# EAGLE schematic AZR3350 (EAGLE 9.2.2)
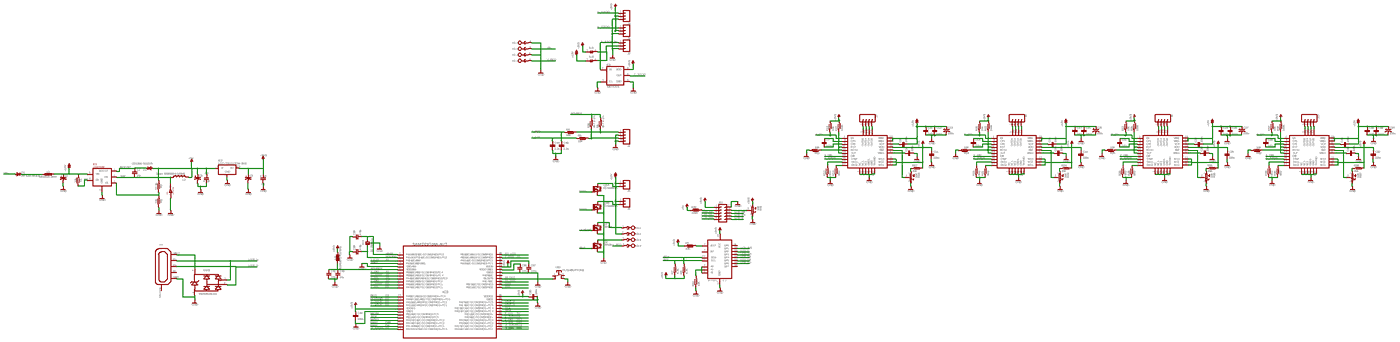
[diagram p0: schematic, sheet 1, overview]
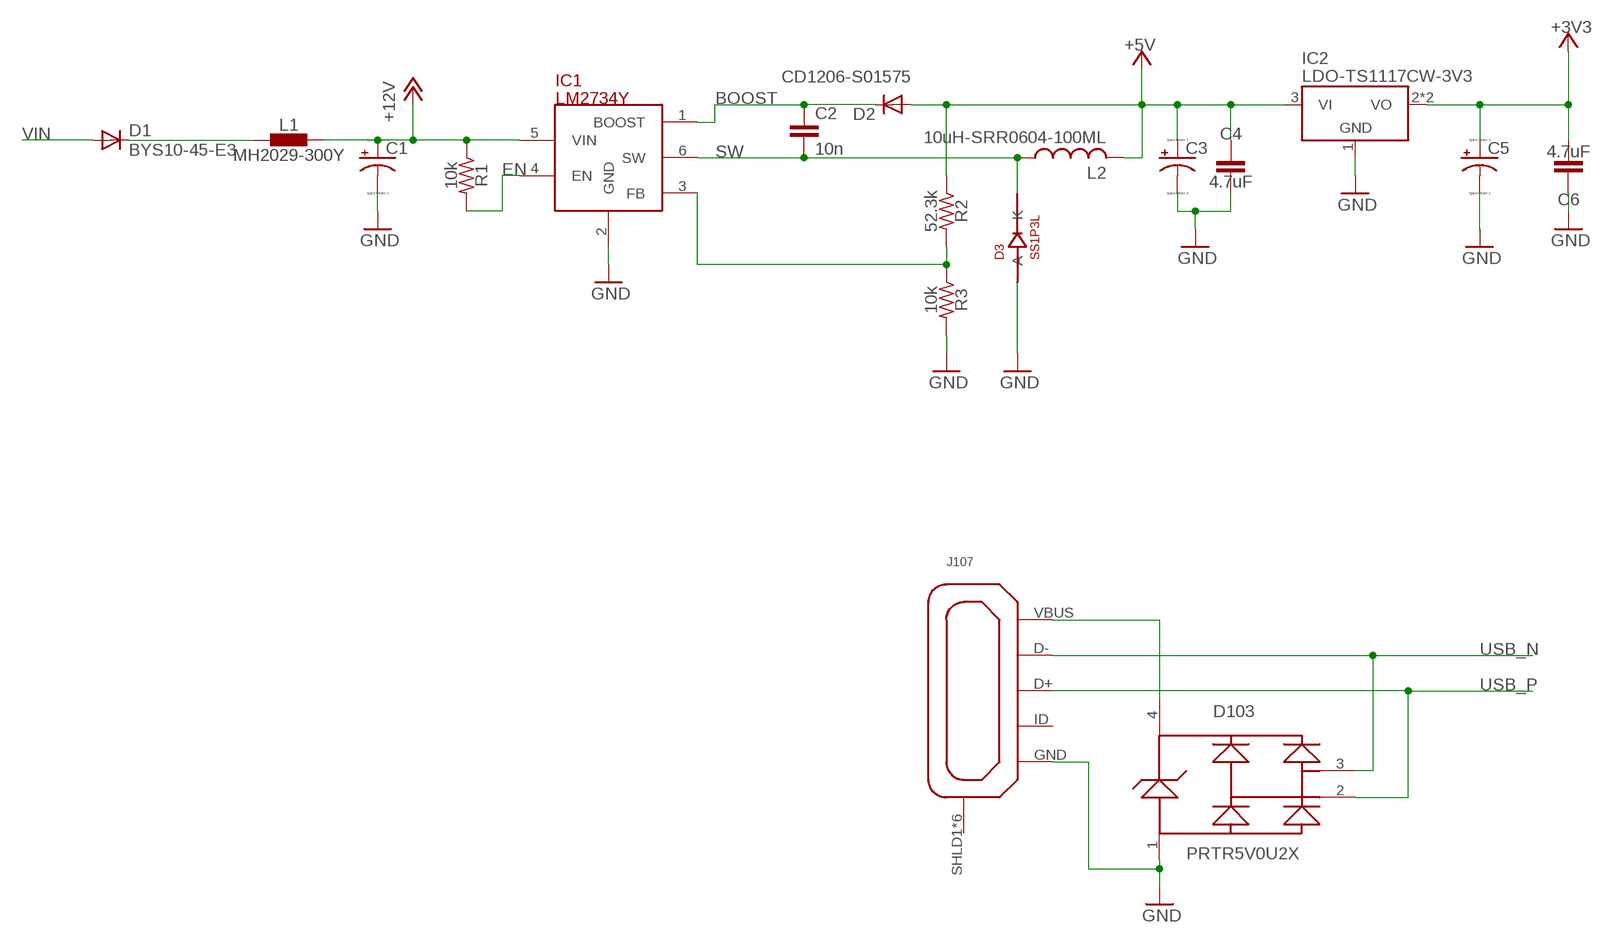
[diagram p1: schematic, sheet 1, part 1 of 4]
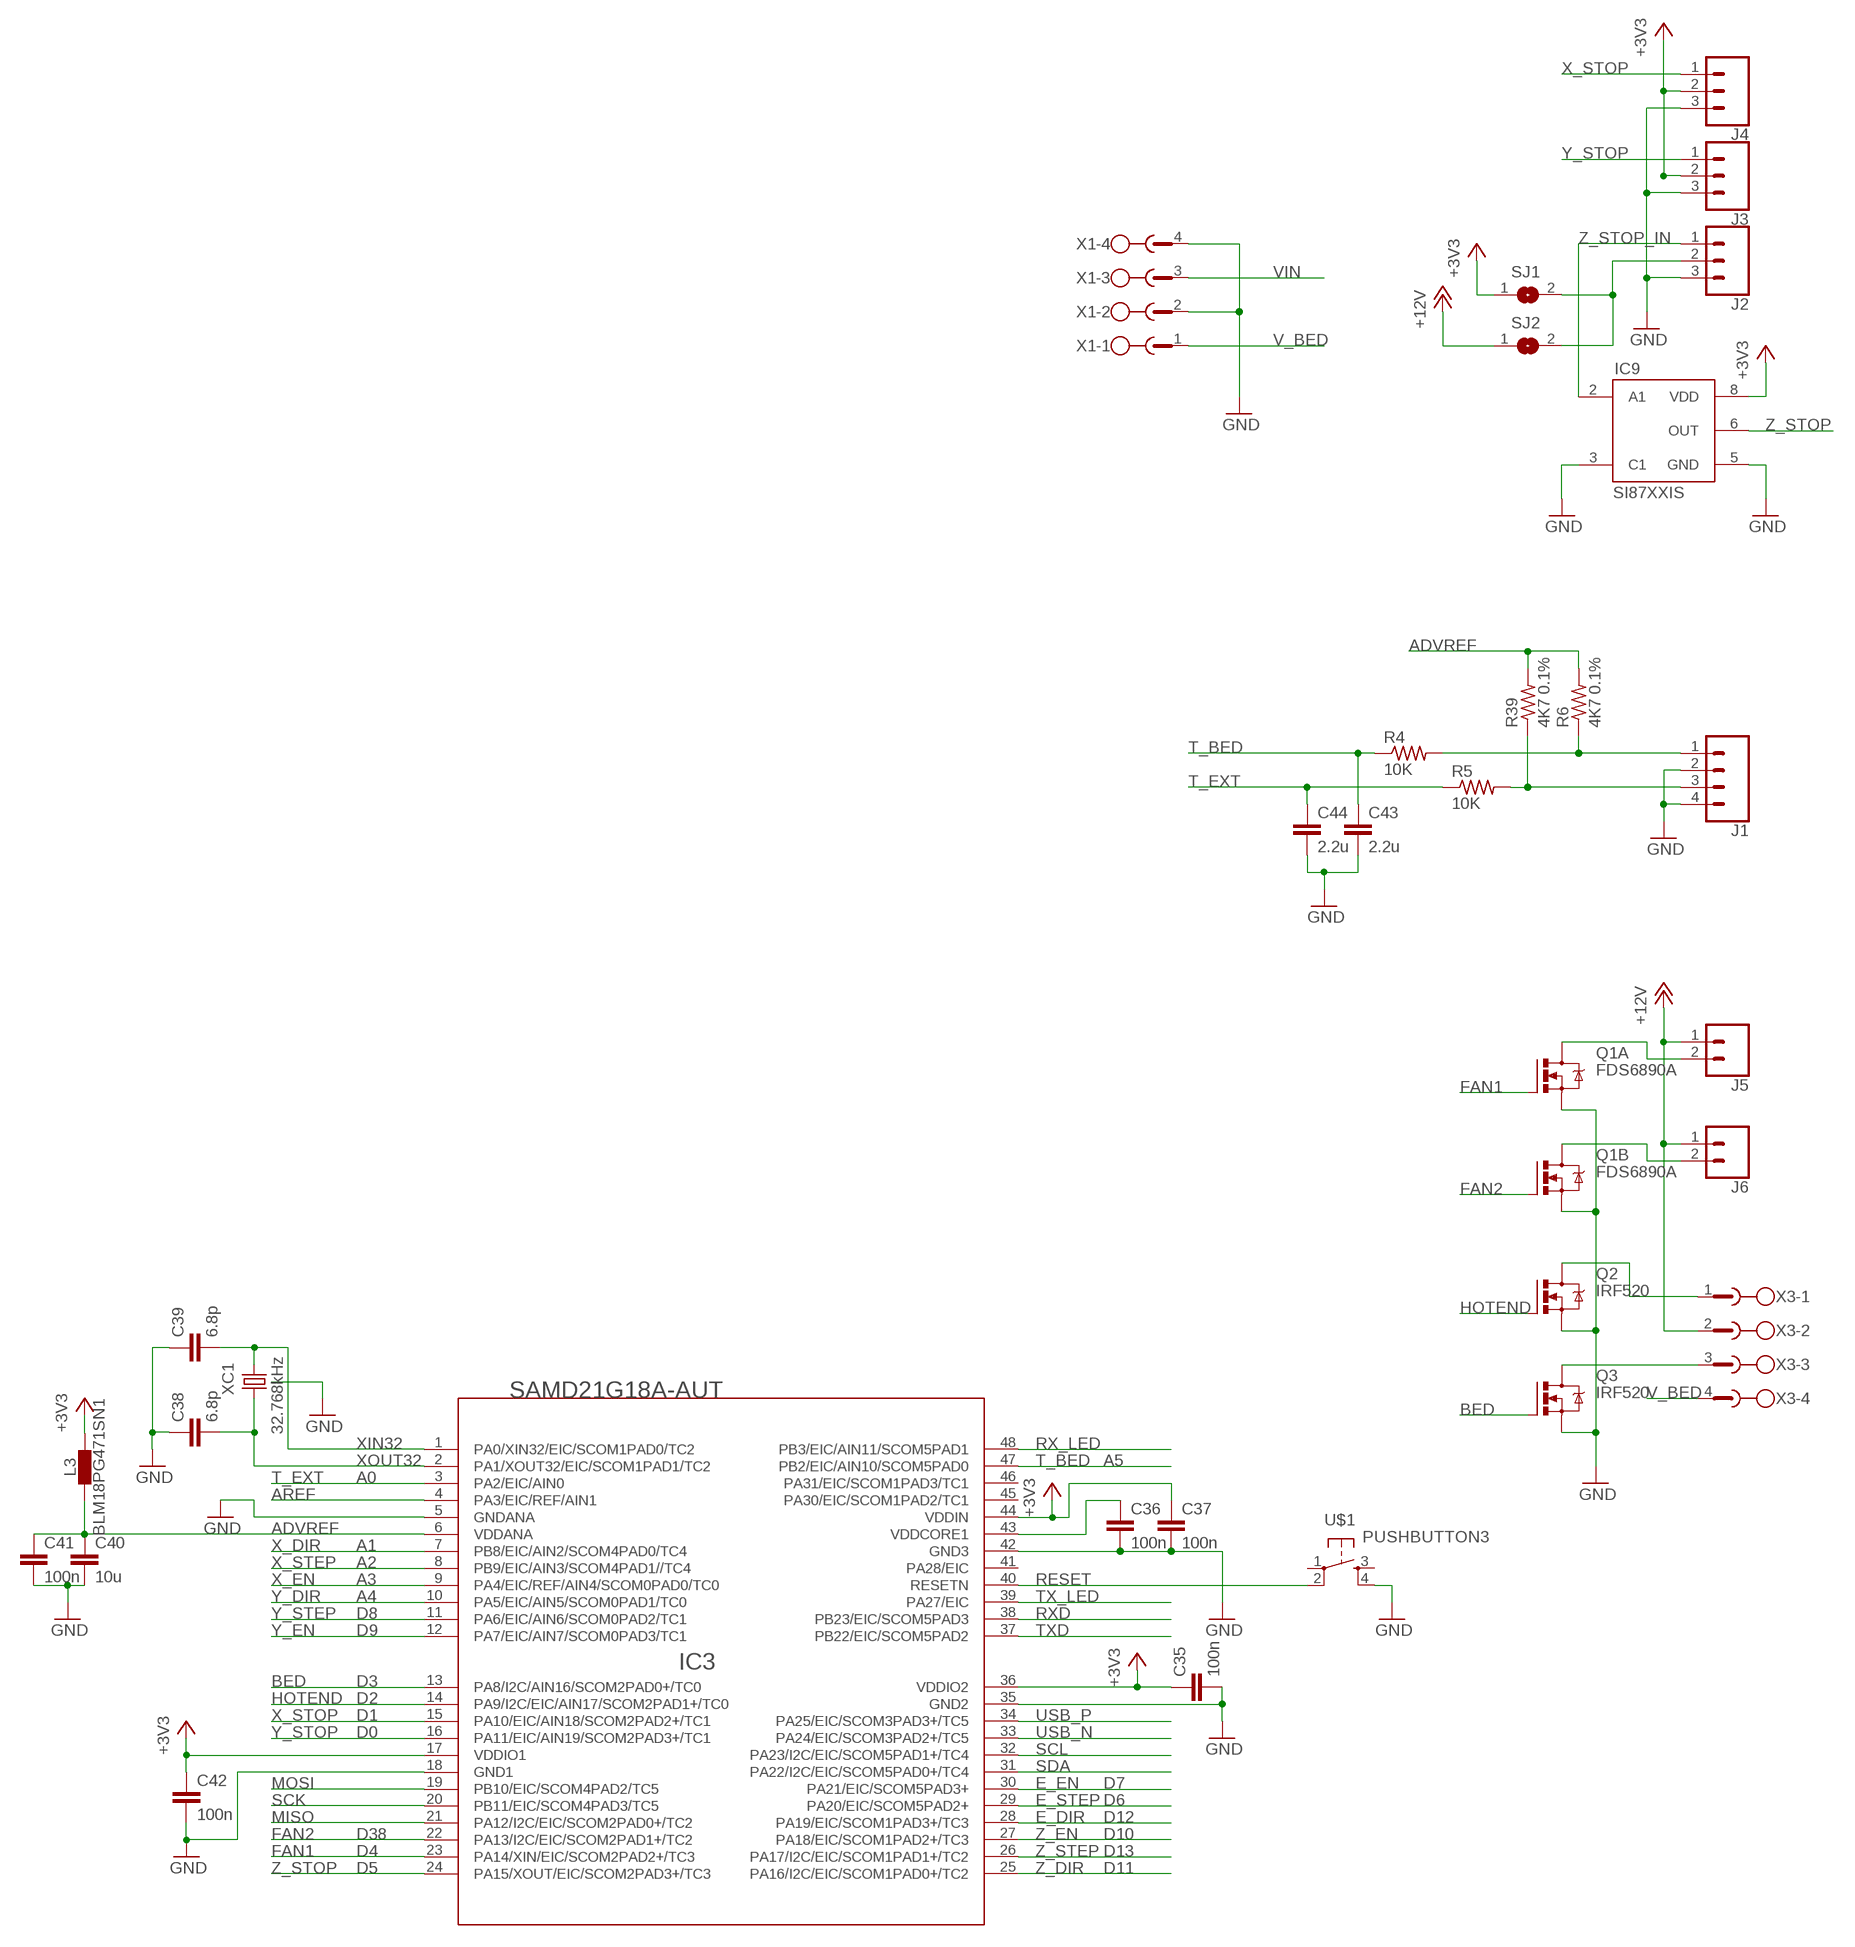
[diagram p2: schematic, sheet 1, part 2 of 4]
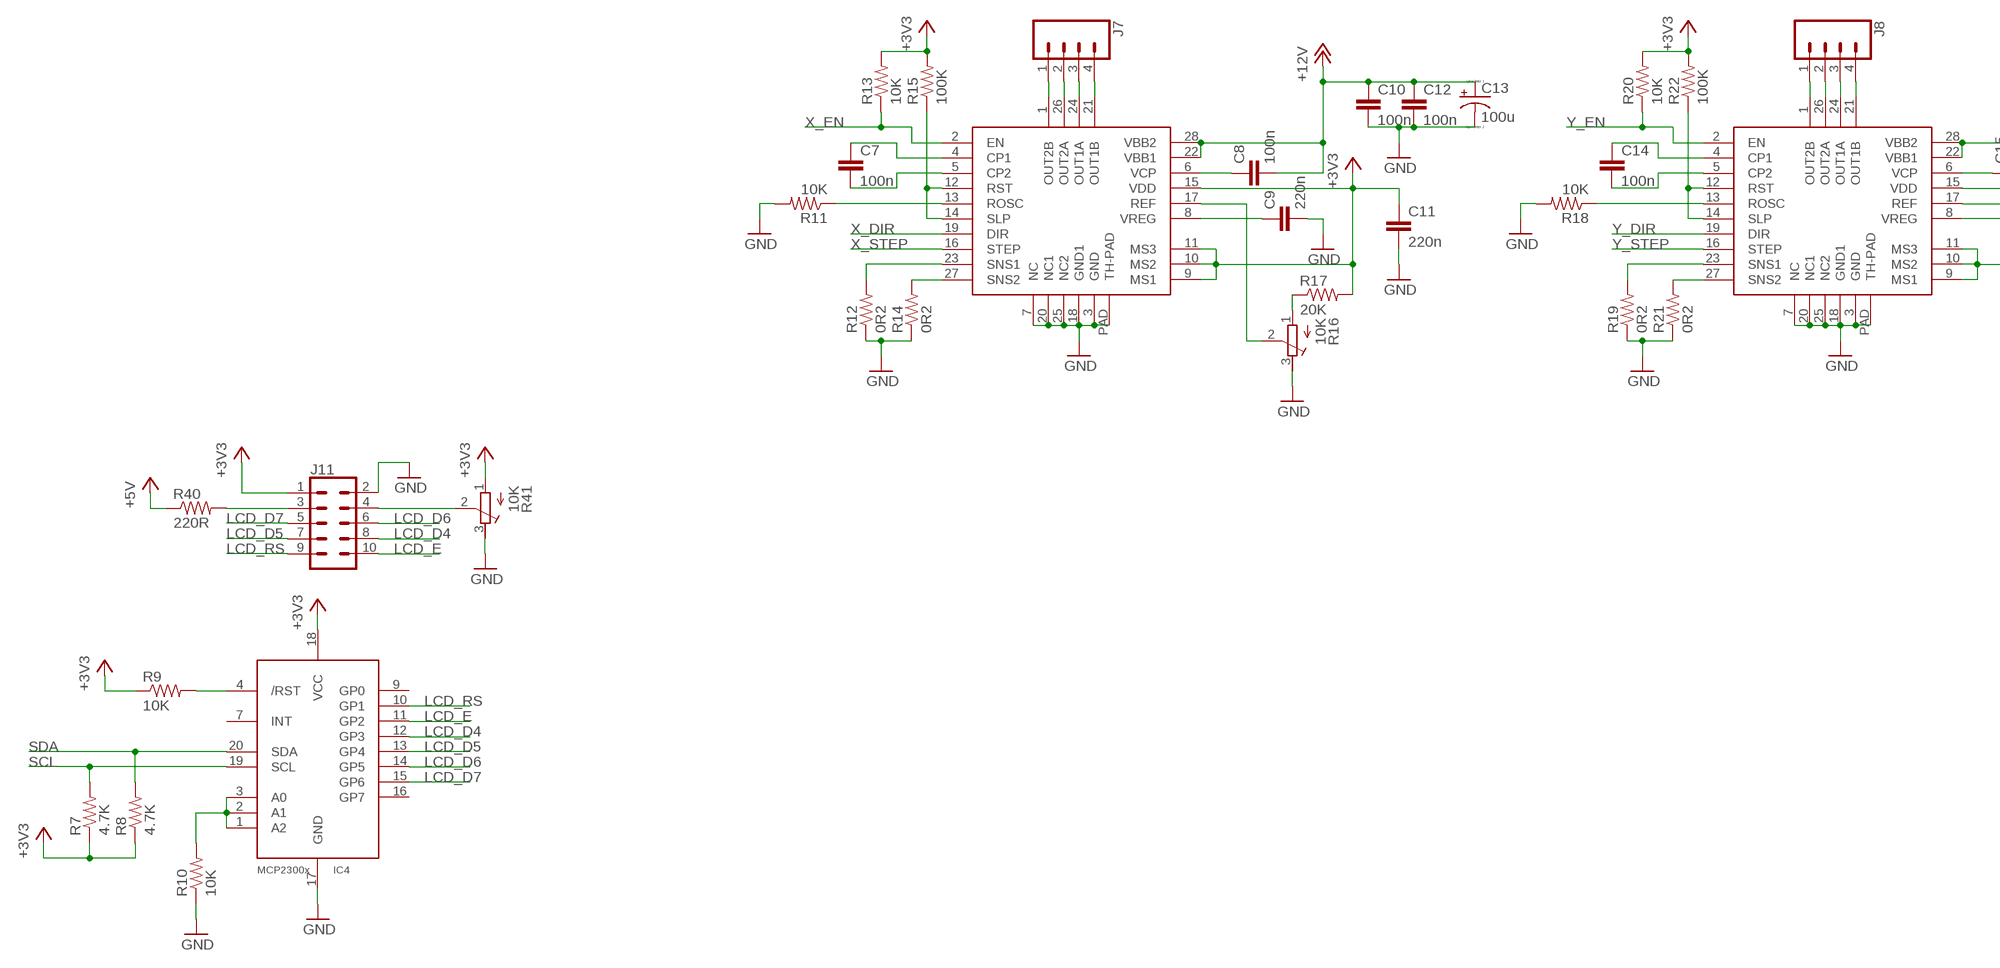
[diagram p3: schematic, sheet 1, part 3 of 4]
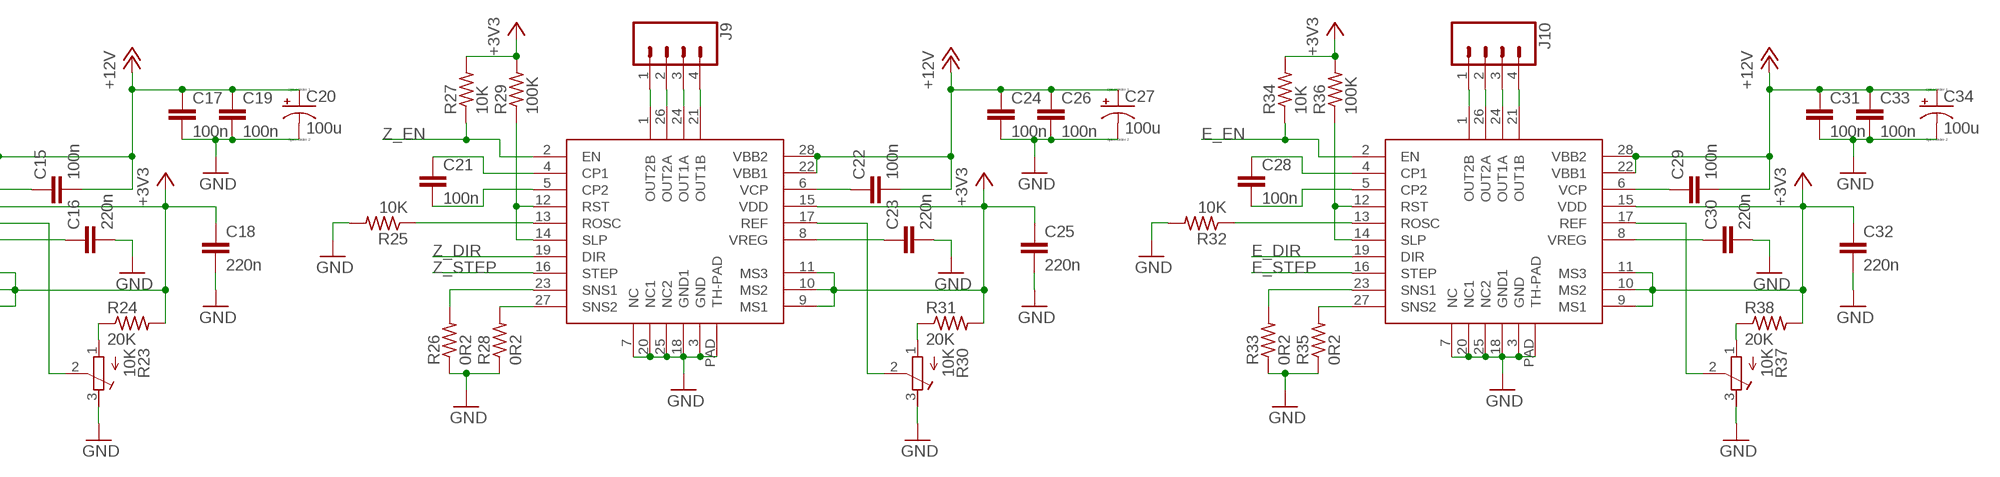
[diagram p4: schematic, sheet 1, part 4 of 4]

## Parts
C1  10uF  CPOL-USD  [PANASONIC_D]
C2  10n  C-EUC0402  [C0402]
C3  47u  CPOL-USD  [PANASONIC_D]
C4  4.7uF  C-EUC0402  [C0402]
C5  10uF  CPOL-USD  [PANASONIC_D]
C6  4.7uF  C-EUC0402  [C0402]
C7  100n  C-EUC0402  [C0402]
C8  100n  C-EUC0402  [C0402]
C9  220n  C-EUC0402  [C0402]
C10  100n  C-EUC0402  [C0402]
C11  220n  C-EUC0402  [C0402]
C12  100n  C-EUC0402  [C0402]
C13  100u  CPOL-USD  [PANASONIC_D]
C14  100n  C-EUC0402  [C0402]
C15  100n  C-EUC0402  [C0402]
C16  220n  C-EUC0402  [C0402]
C17  100n  C-EUC0402  [C0402]
C18  220n  C-EUC0402  [C0402]
C19  100n  C-EUC0402  [C0402]
C20  100u  CPOL-USD  [PANASONIC_D]
C21  100n  C-EUC0402  [C0402]
C22  100n  C-EUC0402  [C0402]
C23  220n  C-EUC0402  [C0402]
C24  100n  C-EUC0402  [C0402]
C25  220n  C-EUC0402  [C0402]
C26  100n  C-EUC0402  [C0402]
C27  100u  CPOL-USD  [PANASONIC_D]
C28  100n  C-EUC0402  [C0402]
C29  100n  C-EUC0402  [C0402]
C30  220n  C-EUC0402  [C0402]
C31  100n  C-EUC0402  [C0402]
C32  220n  C-EUC0402  [C0402]
C33  100n  C-EUC0402  [C0402]
C34  100u  CPOL-USD  [PANASONIC_D]
C35  100n  C-EUC0402  [C0402]
C36  100n  C-EUC0402  [C0402]
C37  100n  C-EUC0402  [C0402]
C38  6.8p  C-EUC0402  [C0402]
C39  6.8p  C-EUC0402  [C0402]
C40  10u  C-EUC0603  [C0603]
C41  100n  C-EUC0402  [C0402]
C42  100n  C-EUC0402  [C0402]
C43  2.2u  C-EUC0402  [C0402]
C44  2.2u  C-EUC0402  [C0402]
D1  BYS10-45-E3  0012_CD1206-S01575  [MINIMELF]
D2  CD1206-S01575  0012_CD1206-S01575  [MINIMELF]
D3  SS1P3L  0025_SS1P3L-M3/84A  [DO220AAL]
D103  PRTR5V0U2XB  [SOT143B]
IC1  LM2734Y  0179_LM2734YMK  [SOT23-6]
IC2  LDO-TS1117CW-3V3  [SOT223]
IC3  SAMD21G18A-AUT  SAMD21G18A  [TQFP48]
IC4  MCP23008  [QFN20]
IC5  A4988  [QFN28-TP]
IC6  A4988  [QFN28-TP]
IC7  A4988  [QFN28-TP]
IC8  A4988  [QFN28-TP]
IC9  SI87XXIS  [SOIC08-FAIRCHILD]
J1  CONN_04SMALL  [1X04_SMALL]
J2  455-1750-1-ND  CONN_03SMALL  [1X03_SMALL]
J3  455-1750-1-ND  CONN_03SMALL  [1X03_SMALL]
J4  455-1750-1-ND  CONN_03SMALL  [1X03_SMALL]
J5  CONN_02  [1X02]
J6  CONN_02  [1X02]
J7  CONN_04  [1X04]
J8  CONN_04  [1X04]
J9  CONN_04  [1X04]
J10  CONN_04  [1X04]
J11  CONN_05X2PTH  [2X5]
J107  ZX62-AB-5PA  [USB-MICRO-10103594]
L1  MH2029-300Y  INDUCTOR-0805  [C0805]
L2  10uH-SRR0604-100ML  0031_SRR0604-100ML  [SRR0604]
L3  BLM18PG471SN1  INDUCTOR-0603  [C0603]
Q1  FDS6890A  [M08A]
Q2  IRF520  [TO220BV]
Q3  IRF520  [TO220BV]
R1  10k  R-US_R0402  [R0402]
R2  52.3k  R-US_R0402  [R0402]
R3  10k  R-US_R0402  [R0402]
R4  10K  R-US_R0402  [R0402]
R5  10K  R-US_R0402  [R0402]
R6  4K7 0.1%  R-US_R0402  [R0402]
R7  4.7K  R-US_R0402  [R0402]
R8  4.7K  R-US_R0402  [R0402]
R9  10K  R-US_R0402  [R0402]
R10  10K  R-US_R0402  [R0402]
R11  10K  R-US_R0402  [R0402]
R12  0R2  R-US_R0805  [R0805]
R13  10K  R-US_R0402  [R0402]
R14  0R2  R-US_R0805  [R0805]
R15  100K  R-US_R0402  [R0402]
R16  10K  R-TRIMM3103  [RTRIM3103]
R17  20K  R-US_R0402  [R0402]
R18  10K  R-US_R0402  [R0402]
R19  0R2  R-US_R0805  [R0805]
R20  10K  R-US_R0402  [R0402]
R21  0R2  R-US_R0805  [R0805]
R22  100K  R-US_R0402  [R0402]
R23  10K  R-TRIMM3103  [RTRIM3103]
R24  20K  R-US_R0402  [R0402]
R25  10K  R-US_R0402  [R0402]
R26  0R2  R-US_R0805  [R0805]
R27  10K  R-US_R0402  [R0402]
R28  0R2  R-US_R0805  [R0805]
R29  100K  R-US_R0402  [R0402]
R30  10K  R-TRIMM3103  [RTRIM3103]
R31  20K  R-US_R0402  [R0402]
R32  10K  R-US_R0402  [R0402]
R33  0R2  R-US_R0805  [R0805]
R34  10K  R-US_R0402  [R0402]
R35  0R2  R-US_R0805  [R0805]
R36  100K  R-US_R0402  [R0402]
R37  10K  R-TRIMM3103  [RTRIM3103]
R38  20K  R-US_R0402  [R0402]
R39  4K7 0.1%  R-US_R0402  [R0402]
R40  220R  R-US_R0402  [R0402]
R41  10K  R-TRIMM3103  [RTRIM3103]
SJ1  SJ  [SJ]
SJ2  SJ  [SJ]
U$1  PUSHBUTTON3  [TS42_4PINS]
X1  MSTBA4  [MSTBA4]
X3  MSTBV4  [MSTBV4]
XC1  32.768kHz  CRYSTALSMD  [CRYSTAL_TC26SMD]

## Nets
+3V3: C5.+ C6.2 C11.1 C18.1 C25.1 C32.1 C35.1 C37.1 C42.1 IC2.2(VO) IC2.4(VO) IC3.17(VDDIO1) IC3.36(VDDIO2) IC3.44(VDDIN) IC4.18(VCC) IC5.9(MS1) IC5.10(MS2) IC5.11(MS3) IC5.15(VDD) IC6.9(MS1) IC6.10(MS2) IC6.11(MS3) IC6.15(VDD) IC7.9(MS1) IC7.10(MS2) IC7.11(MS3) IC7.15(VDD) IC8.9(MS1) IC8.10(MS2) IC8.11(MS3) IC8.15(VDD) IC9.8(VDD) J3.2 J4.2 J11.1 L3.2 R7.1 R8.1 R9.1 R13.2 R15.2 R17.2 R20.2 R22.2 R24.2 R27.2 R29.2 R31.2 R34.2 R36.2 R38.2 R41.1(A) SJ1.1
+5V [usbvcc]: C3.+ C4.1 D2.A IC2.3(VI) L2.P$2 R2.1 R40.1
+12V: C1.+ C8.2 C10.1 C12.1 C13.+ C15.2 C17.1 C19.1 C20.+ C22.2 C24.1 C26.1 C27.+ C29.2 C31.1 C33.1 C34.+ IC1.5(VIN) IC5.22(VBB1) IC5.28(VBB2) IC6.22(VBB1) IC6.28(VBB2) IC7.22(VBB1) IC7.28(VBB2) IC8.22(VBB1) IC8.28(VBB2) J5.1 J6.1 L1.2 R1.1 SJ2.1 X3.2
ADVREF: C40.1 C41.1 IC3.6(VDDANA) L3.1 R6.2 R39.2
AREF: IC3.4(PA3/EIC/REF/AIN1)
BED: IC3.13(PA8/I2C/AIN16/SCOM2PAD0+/TC0) Q3.G
BOOST: C2.1 D2.C IC1.1(BOOST)
CP1E: C28.1 IC8.4(CP1)
CP1X: C7.1 IC5.4(CP1)
CP1Y: C14.1 IC6.4(CP1)
CP1Z: C21.1 IC7.4(CP1)
CP2E: C28.2 IC8.5(CP2)
CP2X: C7.2 IC5.5(CP2)
CP2Y: C14.2 IC6.5(CP2)
CP2Z: C21.2 IC7.5(CP2)
E_DIR: IC3.28(PA19/EIC/SCOM1PAD3+/TC3) IC8.19(DIR)
E_EN: IC3.30(PA21/EIC/SCOM5PAD3+) IC8.2(EN) R34.1
E_STEP: IC3.29(PA20/EIC/SCOM5PAD2+) IC8.16(STEP)
EN: IC1.4(EN) R1.2
FAN1: IC3.23(PA14/XIN/EIC/SCOM2PAD2+/TC3) Q1.2(A:G)
FAN2: IC3.22(PA13/I2C/EIC/SCOM2PAD1+/TC2) Q1.4(B:G)
FB: IC1.3(FB) R2.2 R3.1
GND: C1.- C3.- C4.2 C5.- C6.1 C9.2 C10.2 C11.2 C12.2 C13.- C16.2 C17.2 C18.2 C19.2 C20.- C23.2 C24.2 C25.2 C26.2 C27.- C30.2 C31.2 C32.2 C33.2 C34.- C35.2 C36.2 C37.2 C38.1 C39.1 C40.2 C41.2 C42.2 C43.2 C44.2 D3.P$2(A) D103.1 IC1.2(GND) IC2.1(GND) IC3.5(GNDANA) IC3.18(GND1) IC3.35(GND2) IC3.42(GND3) IC4.17(GND) IC5.3(GND) IC5.7(NC) IC5.18(GND1) IC5.20(NC1) IC5.25(NC2) IC5.PAD(TH-PAD) IC6.3(GND) IC6.7(NC) IC6.18(GND1) IC6.20(NC1) IC6.25(NC2) IC6.PAD(TH-PAD) IC7.3(GND) IC7.7(NC) IC7.18(GND1) IC7.20(NC1) IC7.25(NC2) IC7.PAD(TH-PAD) IC8.3(GND) IC8.7(NC) IC8.18(GND1) IC8.20(NC1) IC8.25(NC2) IC8.PAD(TH-PAD) IC9.3(C1) IC9.5(GND) J1.2 J1.4 J2.3 J3.3 J4.3 J11.2 J107.GND Q1.1(A:S) Q1.3(B:S) Q2.S Q3.S R3.2 R10.1 R11.2 R12.1 R14.1 R16.3(E) R18.2 R19.1 R21.1 R23.3(E) R25.2 R26.1 R28.1 R30.3(E) R32.2 R33.1 R35.1 R37.3(E) R41.3(E) U$1.4 X1.2 X1.4 XC1.P$1(GND)
HOTEND: IC3.14(PA9/I2C/EIC/AIN17/SCOM2PAD1+/TC0) Q2.G
LCD_D4: IC4.12(GP3) J11.8
LCD_D5: IC4.13(GP4) J11.7
LCD_D6: IC4.14(GP5) J11.6
LCD_D7: IC4.15(GP6) J11.5
LCD_E: IC4.11(GP2) J11.10
LCD_RS: IC4.10(GP1) J11.9
MISO: IC3.21(PA12/I2C/EIC/SCOM2PAD0+/TC2)
MOSI: IC3.19(PB10/EIC/SCOM4PAD2/TC5)
N$1: D1.C L1.1
N$2: J1.1 R4.2 R6.1
N$3: J1.3 R5.2 R39.1
N$4: IC6.12(RST) IC6.14(SLP) R22.1
N$5: J11.3 R40.2
N$6: IC5.1(OUT2B) J7.1
N$7: IC5.26(OUT2A) J7.2
N$8: IC5.24(OUT1A) J7.3
N$9: IC5.21(OUT1B) J7.4
N$10: J11.4 R41.2(S)
N$11: D103.4 J107.VBUS(VUSB)
N$12: J2.2 SJ1.2 SJ2.2
N$14: IC6.1(OUT2B) J8.1
N$15: IC6.26(OUT2A) J8.2
N$16: IC6.24(OUT1A) J8.3
N$17: IC6.21(OUT1B) J8.4
N$19: R23.1(A) R24.1
N$21: J6.2 Q1.5(B:D) Q1.6(B:D)
N$22: J5.2 Q1.7(A:D) Q1.8(A:D)
N$23: Q2.D X3.1
N$24: Q3.D X3.3
N$28: IC4.4(/RST) R9.2
N$29: IC4.1(A2) IC4.2(A1) IC4.3(A0) R10.2
N$31: IC5.12(RST) IC5.14(SLP) R15.1
N$38: R16.1(A) R17.1
N$41: IC7.12(RST) IC7.14(SLP) R29.1
N$46: IC7.1(OUT2B) J9.1
N$47: IC7.26(OUT2A) J9.2
N$48: IC7.24(OUT1A) J9.3
N$49: IC7.21(OUT1B) J9.4
N$51: R30.1(A) R31.1
N$55: IC8.12(RST) IC8.14(SLP) R36.1
N$60: IC8.1(OUT2B) J10.1
N$61: IC8.26(OUT2A) J10.2
N$62: IC8.24(OUT1A) J10.3
N$63: IC8.21(OUT1B) J10.4
N$65: R37.1(A) R38.1
REFE: IC8.17(REF) R37.2(S)
REFX: IC5.17(REF) R16.2(S)
REFY: IC6.17(REF) R23.2(S)
REFZ: IC7.17(REF) R30.2(S)
RESET: IC3.40(RESETN) U$1.2
ROSCE: IC8.13(ROSC) R32.1
ROSCX: IC5.13(ROSC) R11.1
ROSCY: IC6.13(ROSC) R18.1
ROSCZ: IC7.13(ROSC) R25.1
RX_LED: IC3.48(PB3/EIC/AIN11/SCOM5PAD1)
RXD: IC3.38(PB23/EIC/SCOM5PAD3)
SCK: IC3.20(PB11/EIC/SCOM4PAD3/TC5)
SCL: IC3.32(PA23/I2C/EIC/SCOM5PAD1+/TC4) IC4.19(SCL) R7.2
SDA: IC3.31(PA22/I2C/EIC/SCOM5PAD0+/TC4) IC4.20(SDA) R8.2
SNS1E: IC8.23(SNS1) R33.2
SNS1X: IC5.23(SNS1) R12.2
SNS1Y: IC6.23(SNS1) R19.2
SNS1Z: IC7.23(SNS1) R26.2
SNS2E: IC8.27(SNS2) R35.2
SNS2X: IC5.27(SNS2) R14.2
SNS2Y: IC6.27(SNS2) R21.2
SNS2Z: IC7.27(SNS2) R28.2
SW [USB]: C2.2 D3.P$1(K) IC1.6(SW) L2.P$1
T_BED: C43.1 IC3.47(PB2/EIC/AIN10/SCOM5PAD0) R4.1
T_EXT: C44.1 IC3.3(PA2/EIC/AIN0) R5.1
TX_LED: IC3.39(PA27/EIC)
TXD: IC3.37(PB22/EIC/SCOM5PAD2)
USB_N [diff]: D103.3 IC3.33(PA24/EIC/SCOM3PAD2+/TC5) J107.D-
USB_P [diff]: D103.2 IC3.34(PA25/EIC/SCOM3PAD3+/TC5) J107.D+
V_BED: X1.1 X3.4
VCPE: C29.1 IC8.6(VCP)
VCPX: C8.1 IC5.6(VCP)
VCPY: C15.1 IC6.6(VCP)
VCPZ: C22.1 IC7.6(VCP)
VDDCORE: C36.1 IC3.43(VDDCORE1)
VIN: D1.A X1.3
VREGE: C30.1 IC8.8(VREG)
VREGX: C9.1 IC5.8(VREG)
VREGY: C16.1 IC6.8(VREG)
VREGZ: C23.1 IC7.8(VREG)
X_DIR: IC3.7(PB8/EIC/AIN2/SCOM4PAD0/TC4) IC5.19(DIR)
X_EN: IC3.9(PA4/EIC/REF/AIN4/SCOM0PAD0/TC0) IC5.2(EN) R13.1
X_STEP: IC3.8(PB9/EIC/AIN3/SCOM4PAD1//TC4) IC5.16(STEP)
X_STOP: IC3.15(PA10/EIC/AIN18/SCOM2PAD2+/TC1) J4.1
XIN32: C39.2 IC3.1(PA0/XIN32/EIC/SCOM1PAD0/TC2) XC1.2
XOUT32: C38.2 IC3.2(PA1/XOUT32/EIC/SCOM1PAD1/TC2) XC1.1
Y_DIR: IC3.10(PA5/EIC/AIN5/SCOM0PAD1/TC0) IC6.19(DIR)
Y_EN: IC3.12(PA7/EIC/AIN7/SCOM0PAD3/TC1) IC6.2(EN) R20.1
Y_STEP: IC3.11(PA6/EIC/AIN6/SCOM0PAD2/TC1) IC6.16(STEP)
Y_STOP: IC3.16(PA11/EIC/AIN19/SCOM2PAD3+/TC1) J3.1
Z_DIR: IC3.25(PA16/I2C/EIC/SCOM1PAD0+/TC2) IC7.19(DIR)
Z_EN: IC3.27(PA18/EIC/SCOM1PAD2+/TC3) IC7.2(EN) R27.1
Z_STEP: IC3.26(PA17/I2C/EIC/SCOM1PAD1+/TC2) IC7.16(STEP)
Z_STOP: IC3.24(PA15/XOUT/EIC/SCOM2PAD3+/TC3) IC9.6(OUT)
Z_STOP_IN: IC9.2(A1) J2.1
Unconnected: IC3.41(PA28/EIC) IC3.45(PA30/EIC/SCOM1PAD2/TC1) IC3.46(PA31/EIC/SCOM1PAD3/TC1) IC4.7(INT) IC4.9(GP0) IC4.16(GP7) J107.ID J107.SHLD1(SH) J107.SHLD2(SH) J107.SHLD3(SH) J107.SHLD4(SH) J107.SHLD5(SH) J107.SHLD6(SH) U$1.1 U$1.3

## Notes on the sheet
- A5
- A0
- A1
- A2
- A3
- A4
- D8
- D9
- D3
- D2
- D1
- D0
- D7
- D6
- D12
- D38 | D10
- D4 | D13
- D5 | D11

## Library data of the parts
C1 C3 C5 C13 C20 C27 C34 = resistor:CPOL-US: POLARIZED CAPACITOR, American symbol
C2 C4 C6-C12 C14-C19 C21-C26 C28-C33 C35-C44 = resistor:C-EU: CAPACITOR, European symbol
D1 = Diodi:0012_CD1206-S01575: small-signal high-speed Switching Diodes CD1206; CASE: 1206; MONTHLY_USAGE: _____; PART_NUMBER: CD1206-S01575; PRICE: _____; SUPPLIER: _____; TYPE: Diodi; VALUE: CD1206-S01575
D2 = Diodi:0012_CD1206-S01575: small-signal high-speed Switching Diodes CD1206; CASE: 1206; MONTHLY_USAGE: _____; PART_NUMBER: CD1206-S01575; PRICE: _____; SUPPLIER: _____; TYPE: Diodi
D3 = Diodi:0025_SS1P3L-M3/84A: 1A 30V Schottky Barrier Rectifiers -SS1P3L-M3/84A; CASE: SMP; MONTHLY_USAGE: _____; PART_NUMBER: SS1P3L-M3/84A; PRICE: _____; SUPPLIER: _____; TYPE: Diodi
D103 = Arduino:PRTR5V0U2X
IC1 = Circuito Integrato:0179_LM2734YMK: 1A Load Step-Down DC-DC Regulator - LM2734Y Switching; CASE: SOT23-5; MONTHLY_USAGE: _____; PART_NUMBER: LM2734YMK; PRICE: _____; SUPPLIER: _____; TYPE: Circuito_Integrato; VALUE: LM2734YMK
IC2 = we-power:LDO: LDOs TS1117 800mA max 15V - compatible NCP1117 1A max 20V TS9011 250mA max 12V - compatible AP2210 300mA max 15V TS5204 150mA max 16V
IC3 = Zero_V1.0:SAMD21G18A: Atmel D21 32bit ARM Cortex-M0 microcontroller - 48 PIN TQFP 256KB flash memory + 32KB SRAM
IC4 = misc:MCP23008
IC5-IC8 = RepRapjr:A4988
IC9 = misc:SI87XX
J1 = SparkFun-Connectors:CONN_04: Multi connection point. Often used as Generic Header-pin footprint for 0.1 inch spaced/style header connections On any of the 0.1 inch spaced packages, you can populate with these: Break Away Headers - Straight <https://www.sparkfun.com/products/116> (PRT-00116) Break Away Male Headers - Right Angle <https://www.sparkfun.com/products/553> (PRT-00553) Female Headers <https://www.sparkfun.com/products/115> (PRT-00115) Break Away Headers - Machine Pin <https://www.sparkfun.com/products/117> (PRT-00117) Break Away Female Headers - Swiss Machine Pin <https://www.sparkfun.com/products/743> (PRT-00743) For SCREWTERMINALS and SPRING TERMINALS visit here: Screw Terimnals on SparkFun.com <https://www.sparkfun.com/search/results?term=Screw+Terminals> (5mm/3.5mm/2.54mm spacing) This device is also useful as a general connection point to wire up your design to another part of your project. Our various solder wires solder well into these plated through hole pads. Hook-Up Wire - Assortment (Stranded, 22 AWG) <https://www.sparkfun.com/products/11375> (PRT-11375) Hook-Up Wire - Assortment (Solid Core, 22 AWG) <https://www.sparkfun.com/products/11367> (PRT-11367) View the entire wire category on our website here <https://www.sparkfun.com/categories/141> Special notes: Molex polarized connector foot print use with SKU : PRT-08231 with associated crimp pins and housings. 1MM SMD Version SKU: PRT-10208
J2-J4 = SparkFun-Connectors:CONN_03: Multi connection point. Often used as Generic Header-pin footprint for 0.1 inch spaced/style header connections On any of the 0.1 inch spaced packages, you can populate with these: Break Away Headers - Straight <https://www.sparkfun.com/products/116> (PRT-00116) Break Away Male Headers - Right Angle <https://www.sparkfun.com/products/553> (PRT-00553) Female Headers <https://www.sparkfun.com/products/115> (PRT-00115) Break Away Headers - Machine Pin <https://www.sparkfun.com/products/117> (PRT-00117) Break Away Female Headers - Swiss Machine Pin <https://www.sparkfun.com/products/743> (PRT-00743) Stackable Header - 3 Pin (Female, 0.1") <https://www.sparkfun.com/products/13875> (PRT-13875) For SCREWTERMINALS and SPRING TERMINALS visit here: Screw Terimnals on SparkFun.com <https://www.sparkfun.com/search/results?term=Screw+Terminals> (5mm/3.5mm/2.54mm spacing) This device is also useful as a general connection point to wire up your design to another part of your project. Our various solder wires solder well into these plated through hole pads. Hook-Up Wire - Assortment (Stranded, 22 AWG) <https://www.sparkfun.com/products/11375> (PRT-11375) Hook-Up Wire - Assortment (Solid Core, 22 AWG) <https://www.sparkfun.com/products/11367> (PRT-11367) View the entire wire category on our website here <https://www.sparkfun.com/categories/141> Special notes: Molex polarized connector foot print use with SKU : PRT-08232 with associated crimp pins and housings.
J5 J6 = SparkFun-Connectors:CONN_02: Multi connection point. Often used as Generic Header-pin footprint for 0.1 inch spaced/style header connections On any of the 0.1 inch spaced packages, you can populate with these: Break Away Headers - Straight <https://www.sparkfun.com/products/116> (PRT-00116) Break Away Male Headers - Right Angle <https://www.sparkfun.com/products/553> (PRT-00553) Female Headers <https://www.sparkfun.com/products/115> (PRT-00115) Break Away Headers - Machine Pin <https://www.sparkfun.com/products/117> (PRT-00117) Break Away Female Headers - Swiss Machine Pin <https://www.sparkfun.com/products/743> (PRT-00743) For SCREWTERMINALS and SPRING TERMINALS visit here: Screw Terimnals on SparkFun.com <https://www.sparkfun.com/search/results?term=Screw+Terminals> (5mm/3.5mm/2.54mm spacing) This device is also useful as a general connection point to wire up your design to another part of your project. Our various solder wires solder well into these plated through hole pads. Hook-Up Wire - Assortment (Stranded, 22 AWG) <https://www.sparkfun.com/products/11375> (PRT-11375) Hook-Up Wire - Assortment (Solid Core, 22 AWG) <https://www.sparkfun.com/products/11367> (PRT-11367) View the entire wire category on our website here <https://www.sparkfun.com/categories/141> Special notes: Molex polarized connector foot print use with: PRT-08233 with associated crimp pins and housings. 2.54_SCREWTERM for use with PRT-10571. 3.5mm Screw Terminal footprints for PRT-08084 5mm Screw Terminal footprints for use with PRT-08432
J7-J10 = SparkFun-Connectors:CONN_04: Multi connection point. Often used as Generic Header-pin footprint for 0.1 inch spaced/style header connections On any of the 0.1 inch spaced packages, you can populate with these: Break Away Headers - Straight <https://www.sparkfun.com/products/116> (PRT-00116) Break Away Male Headers - Right Angle <https://www.sparkfun.com/products/553> (PRT-00553) Female Headers <https://www.sparkfun.com/products/115> (PRT-00115) Break Away Headers - Machine Pin <https://www.sparkfun.com/products/117> (PRT-00117) Break Away Female Headers - Swiss Machine Pin <https://www.sparkfun.com/products/743> (PRT-00743) For SCREWTERMINALS and SPRING TERMINALS visit here: Screw Terimnals on SparkFun.com <https://www.sparkfun.com/search/results?term=Screw+Terminals> (5mm/3.5mm/2.54mm spacing) This device is also useful as a general connection point to wire up your design to another part of your project. Our various solder wires solder well into these plated through hole pads. Hook-Up Wire - Assortment (Stranded, 22 AWG) <https://www.sparkfun.com/products/11375> (PRT-11375) Hook-Up Wire - Assortment (Solid Core, 22 AWG) <https://www.sparkfun.com/products/11367> (PRT-11367) View the entire wire category on our website here <https://www.sparkfun.com/categories/141> Special notes: Molex polarized connector foot print use with SKU : PRT-08231 with associated crimp pins and housings. 1MM SMD Version SKU: PRT-10208; PROD_ID: CONN-09696
J11 = SparkFun-Connectors:CONN_05X2: Multi connection point. Often used as Generic Header-pin footprint for 0.1 inch spaced/style header connections For AVR SPI programming port, see special device with nice symbol: "AVR_SPI_PROG_5x2.dev" You can populate with any combo of single row headers, but if you'd like an exact match, check these: 2x5 AVR ICSP Male Header <https://www.sparkfun.com/products/778> (PRT-00778) 2x5 Pin Shrouded Header <https://www.sparkfun.com/products/8506> (PRT-08506) On any of the 0.1 inch spaced packages, you can populate with these: Break Away Headers - Straight <https://www.sparkfun.com/products/116> (PRT-00116) Break Away Male Headers - Right Angle <https://www.sparkfun.com/products/553> (PRT-00553) Female Headers <https://www.sparkfun.com/products/115> (PRT-00115) Break Away Headers - Machine Pin <https://www.sparkfun.com/products/117> (PRT-00117) Break Away Female Headers - Swiss Machine Pin <https://www.sparkfun.com/products/743> (PRT-00743) Special note: the shrouded connector mates well with our 5x2 ribbon cables: 2x5 Pin IDC Ribbon Cable <https://www.sparkfun.com/products/8535> (PRT-08535); PROD_ID: CONN-08499; SF_ID: PRT-0778
J107 = Arduino:ZX62-AB-5PA
L1 L3 = Arduino:INDUCTOR: Inductors
L2 = Induttanze:0031_SRR0604-100ML: SRR0604-100ML; CASE: SMD_6,5x6,5; MONTHLY_USAGE: _____; PART_NUMBER: SRR0604-100ML; PRICE: _____; SUPPLIER: _____; TYPE: Induttanze
Q1 = transistor-power:FDS6890A: Dual N-Channel 2.5V Specified PowerTrenchTM MOSFET Source: FDS6890A.pdf
Q2 Q3 = transistor-power:IRF520: HEXFET Power MOSFET
R1-R15 R17-R22 R24-R29 R31-R36 R38-R40 = resistor:R-US_: RESISTOR, American symbol
R16 R23 R30 R37 R41 = resistor:R-TRIMM: Trimm resistor
SJ1 SJ2 = jumper:SJ: SMD solder JUMPER
U$1 = Zero_V1.0:PUSHBUTTON3: TS42 Dongnan Electronics Tact switch VDC 12V - 50mA
X1 = con-phoenix-508:MSTBA4: PHOENIX; MF: FARNELL; MPN: 1757268; OC_FARNELL: 3705195; OC_NEWARK: 71C4163
X3 = con-phoenix-508:MSTBV4: PHOENIX; MPN: MSTBV 2,5/4-GF-5.08; OC_FARNELL: 1792794; OC_NEWARK: 69R9847
XC1 = Arduino:CRYSTAL: Crystals

## Net classes
1 USB: width 0.102 mm, drill 0.1 mm
2 gnd: width 0.102 mm, drill 0.1 mm
3 usbvcc: width 0.102 mm, drill 0.1 mm, clearance 0.15 mm
4 diff: width 0.152 mm